# Altium schematic sheet Jumpers High Low.SchDoc
size A; SheetNumber: 7; SheetTotal: 9
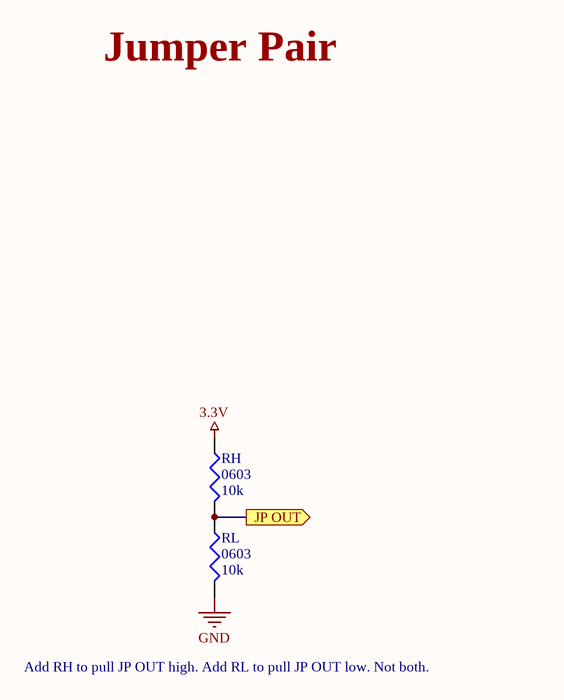
[diagram p0: Jumpers High Low.SchDoc]

## Parts
RH  0603  value 10k  [J1-0603]
RL  0603  value 10k  [J1-0603]

## Ports
JP OUT (out)

## Nets
3.3V: RH.1
GND: RL.2
JP OUT: RH.2 RL.1 ; port JP OUT

## Notes on the sheet
- Jumper Pair
- Add RH to pull JP OUT high. Add RL to pull JP OUT low. Not both.

## Library data of the parts
RH RL = Res3: Resistor; Published: 8-Jun-2000; LatestRevisionDate: 29-May-2009; LatestRevisionNote: IPC-7351 Footprint Added.; PackageReference: J1-0603; Publisher: Altium Limited; PackageDescription: Chip Resistor